# EAGLE schematic tentacle_tip (EAGLE 7.1.0)
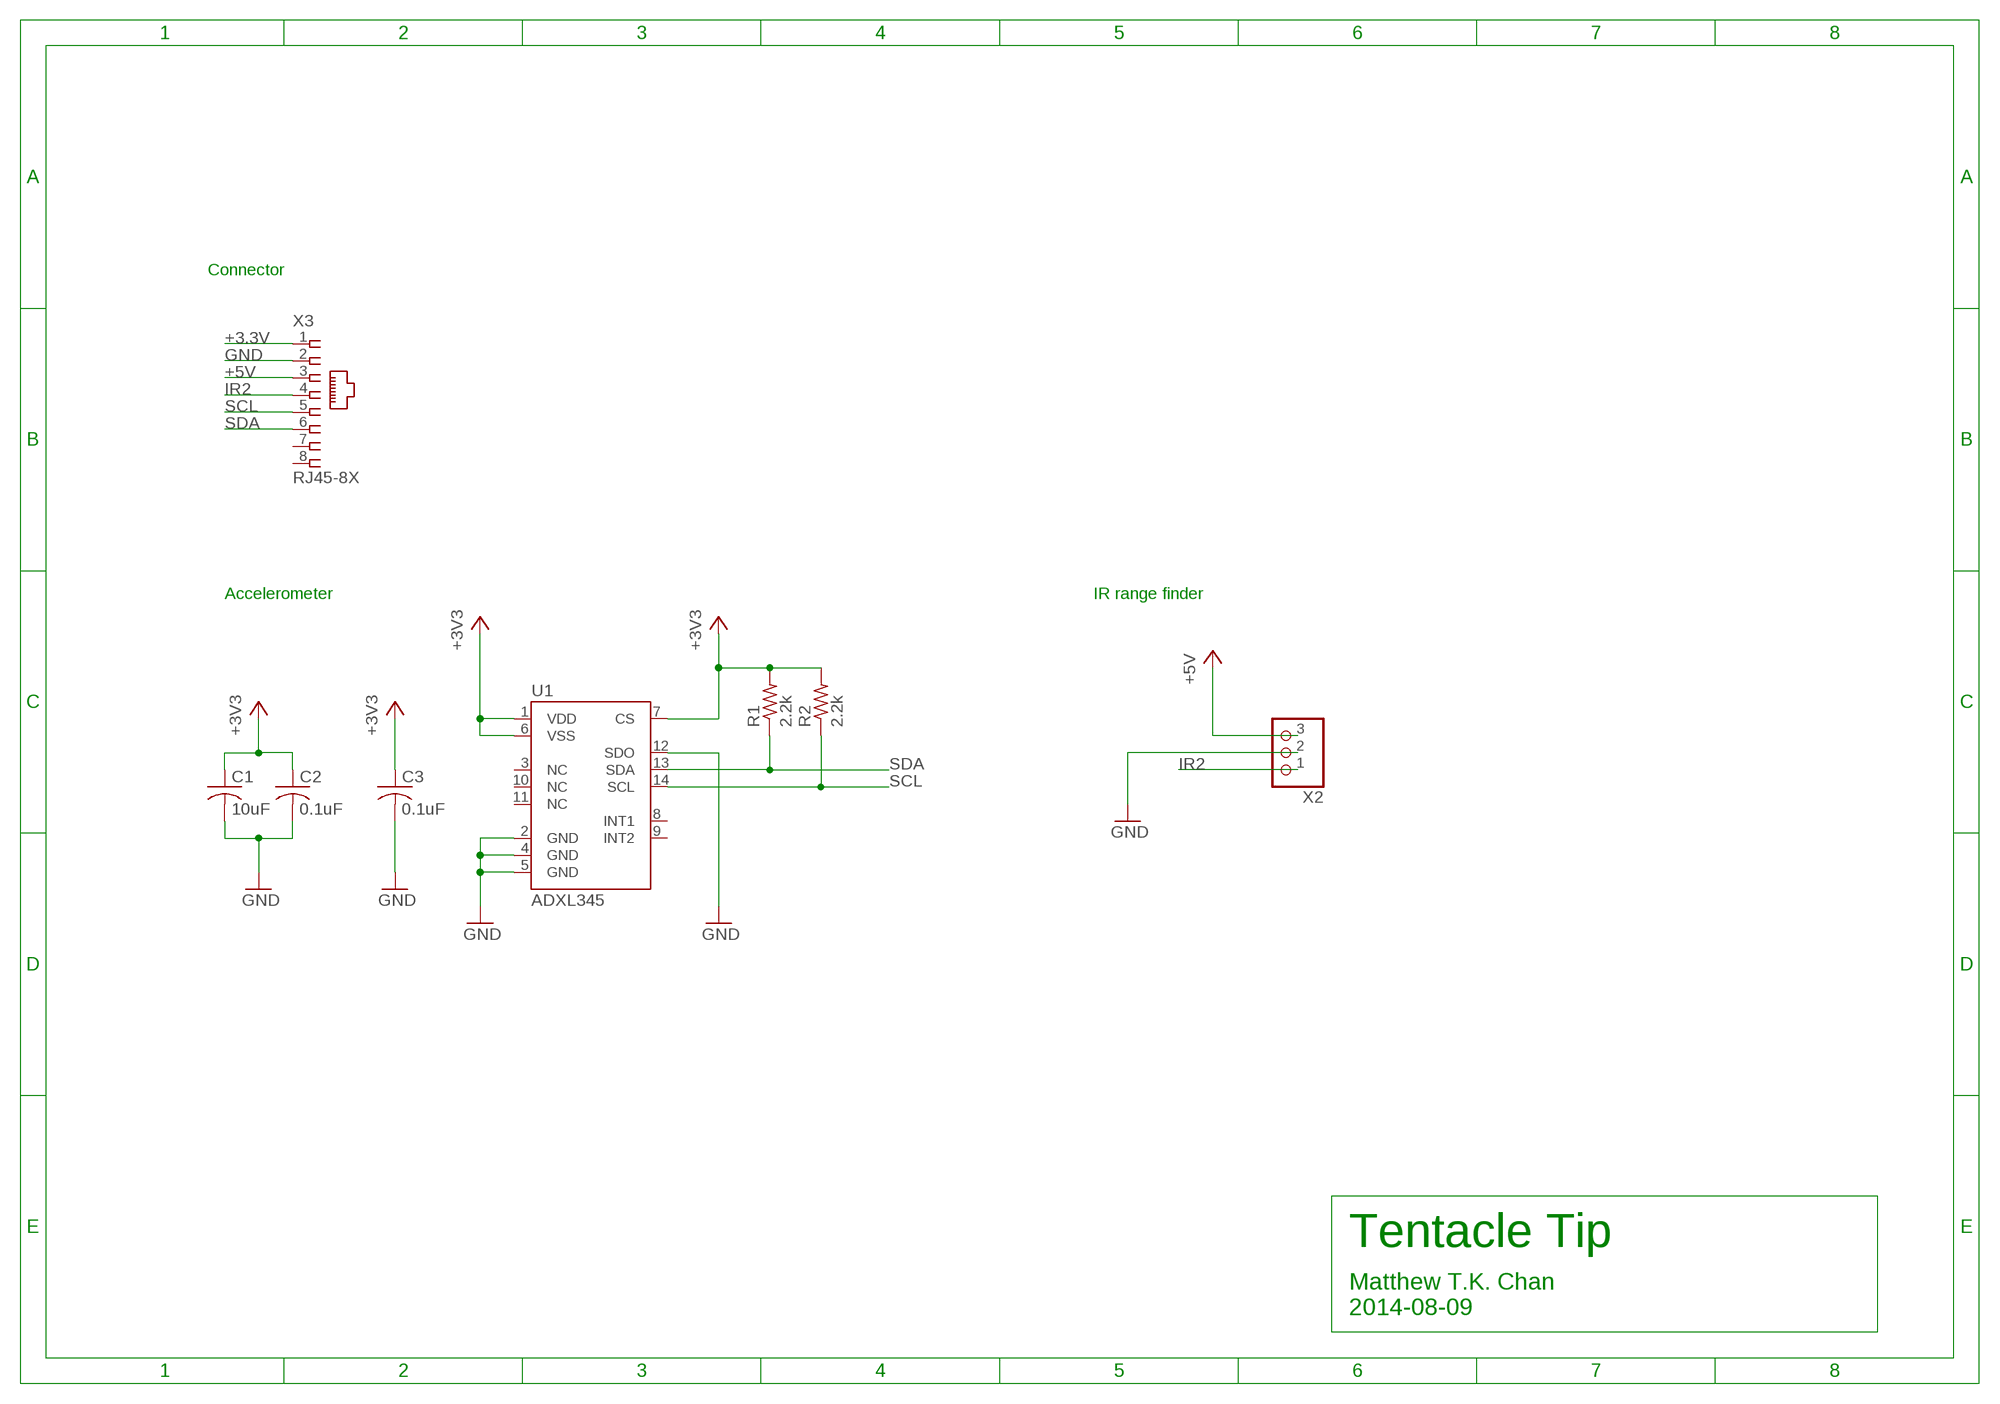
[diagram p0: schematic, sheet 1]

## Parts
C1  10uF  C-USC1206  [C1206]
C2  0.1uF  C-USC0603  [C0603]
C3  0.1uF  C-USC0603  [C0603]
R1  2.2k  R-US_R0603  [R0603]
R2  2.2k  R-US_R0603  [R0603]
U1  ADXL345  ADXL345LONG  [LGA14_LONG]
X2  PINHD-1X3/90  [1X03/90]
X3  RJ45-8X  [RJ45-NO-SHIELD]

## Nets
+3.3V: C1.1 C2.1 C3.1 R1.2 R2.2 U1.1(VDD) U1.6(VSS) U1.7(CS) X3.1 ; supply symbol labelled +3V3
+5V: X2.3 X3.3
GND: C1.2 C2.2 C3.2 U1.2(GND) U1.4(GND) U1.5(GND) U1.12(SDO) X2.2 X3.2
IR2: X2.1 X3.4
SCL: R2.1 U1.14(SCL) X3.5
SDA: R1.1 U1.13(SDA) X3.6
Unconnected: U1.3(NC) U1.8(INT1) U1.9(INT2) U1.10(NC) U1.11(NC) X3.7 X3.8

## Notes on the sheet
- Connector
- Accelerometer | IR range finder
- Tentacle Tip
- Matthew T.K. Chan
  2014-08-09

## Library data of the parts
C1-C3 = rcl:C-US: CAPACITOR, American symbol
R1 R2 = rcl:R-US_: RESISTOR, American symbol
U1 = CBLA_Test_bed_Library:ADXL345
X2 = CBLA_Test_bed_Library:PINHD-1X3: PIN HEADER
X3 = CBLA_Test_bed_Library:RJ45: CORCOM Modular RJ Jacks No Shield Source: www.tycoelectronics.com .. ENG_DS_1654001_1099_RJ_L_0507.pdf; MPN: RJ45-8X; OC_FARNELL: unknown; OC_NEWARK: 16R6101